# EAGLE design controller (EAGLE 6.4)
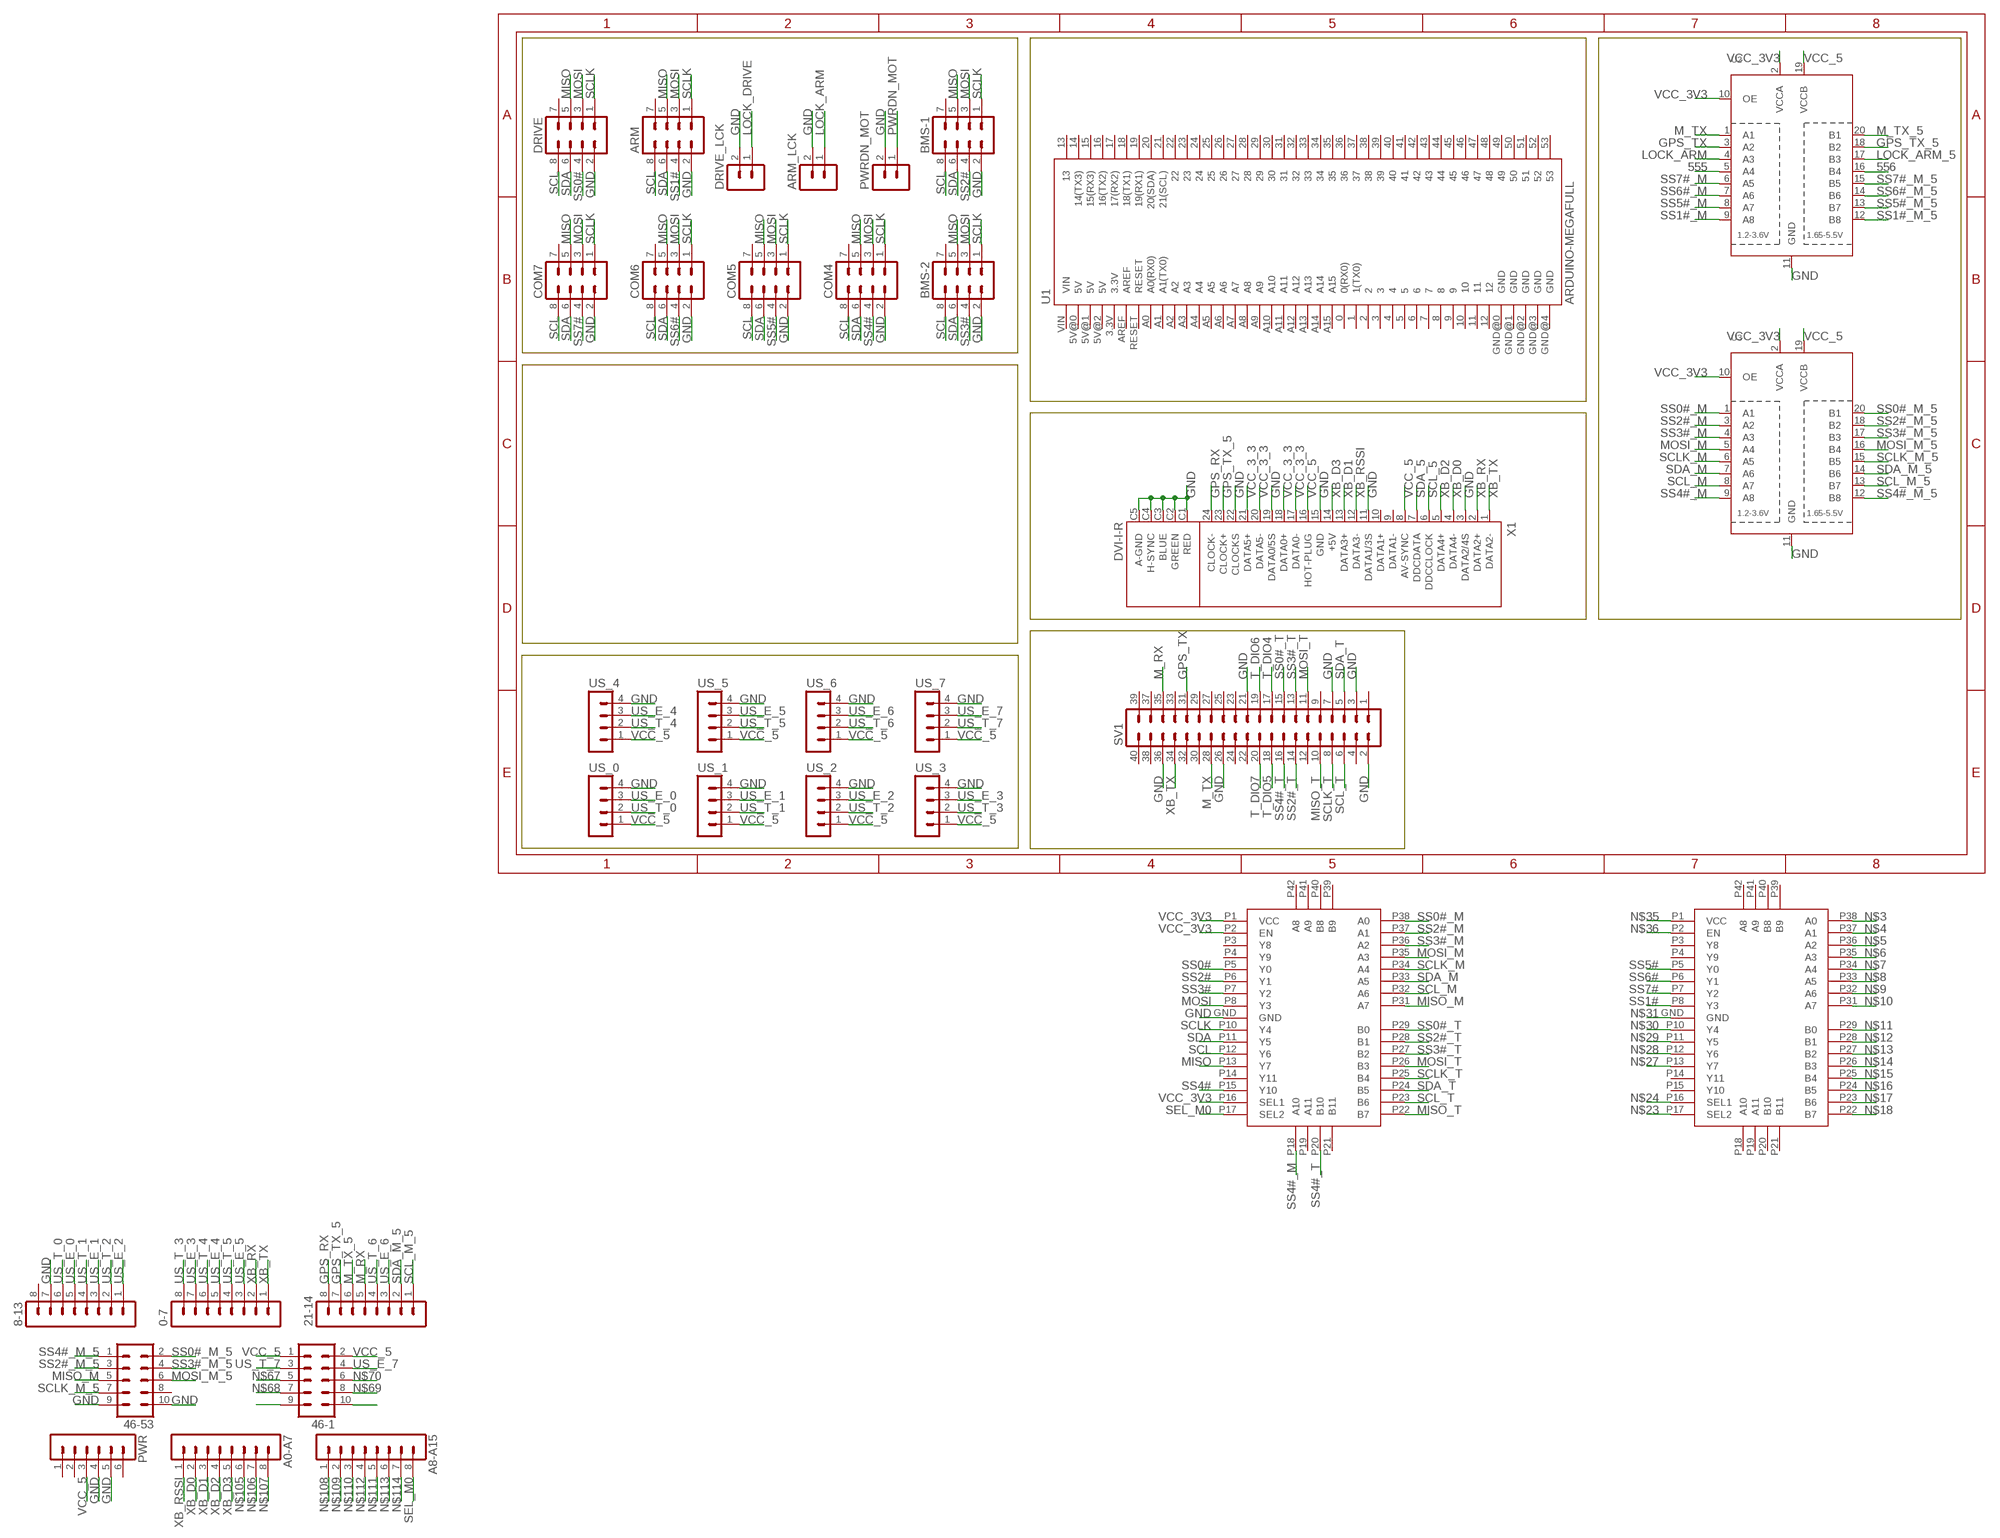
[diagram p0: schematic, sheet 1]

## Parts
0-7  MA08-1  [MA08-1]
8-13  MA08-1  [MA08-1]
21-14  MA08-1  [MA08-1]
46-1  MA05-2  [MA05-2]
46-53  MA05-2  [MA05-2]
A0-A7  MA08-1  [MA08-1]
A8-A15  MA08-1  [MA08-1]
ARM  MA04-2  [MA04-2]
ARM_LCK  MA02-1  [MA02-1]
BMS-1  MA04-2  [MA04-2]
BMS-2  MA04-2  [MA04-2]
COM4  MA04-2  [MA04-2]
COM5  MA04-2  [MA04-2]
COM6  MA04-2  [MA04-2]
COM7  MA04-2  [MA04-2]
DRIVE  MA04-2  [MA04-2]
DRIVE_LCK  MA02-1  [MA02-1]
PWR  MA06-1  [MA06-1]
PWRDN_MOT  MA02-1  [MA02-1]
SV1  MA20-2  [MA20-2]
U1  ARDUINO-MEGAFULL  [ARDUINO_MEGA]
U2  TXB0108PWR  [TSSOP20]
U3  TXB0108PWR  [TSSOP20]
U$5  TS3DV642RUA  [R-PWQFN-N42]
U$6  TS3DV642RUA  [R-PWQFN-N42]
US_0  MA04-1  [MA04-1]
US_1  MA04-1  [MA04-1]
US_2  MA04-1  [MA04-1]
US_3  MA04-1  [MA04-1]
US_4  MA04-1  [MA04-1]
US_5  MA04-1  [MA04-1]
US_6  MA04-1  [MA04-1]
US_7  MA04-1  [MA04-1]
X1  DVI-I-R  [DVI-I-R]

## Nets
555: U2.5(A4)
556: U2.16(B4)
GND: 8-13.7 46-53.9 46-53.10 ARM.2 ARM_LCK.2 BMS-1.2 BMS-2.2 COM4.2 COM5.2 COM6.2 COM7.2 DRIVE.2 DRIVE_LCK.2 PWR.4 PWR.5 PWRDN_MOT.2 SV1.2 SV1.3 SV1.7 SV1.21 SV1.26 SV1.36 U2.11(GND) U3.11(GND) U$5.GND US_0.4 US_1.4 US_2.4 US_3.4 US_4.4 US_5.4 US_6.4 US_7.4 X1.3(DATA2/4S) X1.11(DATA1/3S) X1.15(GND) X1.19(DATA0/5S) X1.22(CLOCKS) X1.C1(RED) X1.C2(GREEN) X1.C3(BLUE) X1.C4(H-SYNC) X1.C5(A-GND)
GPS_RX: 21-14.8 X1.24(CLOCK-)
GPS_TX: SV1.31 U2.3(A2)
GPS_TX_5: 21-14.7 U2.18(B2) X1.23(CLOCK+)
LOCK_ARM: ARM_LCK.1 U2.4(A3)
LOCK_ARM_5: U2.17(B3)
LOCK_DRIVE: DRIVE_LCK.1
M_RX: 21-14.5 SV1.35
M_TX: SV1.28 U2.1(A1)
M_TX_5: 21-14.6 U2.20(B1)
MISO: ARM.5 BMS-1.5 BMS-2.5 COM4.5 COM5.5 COM6.5 COM7.5 DRIVE.5 U$5.P13(Y7)
MISO_M: 46-53.5 U$5.P31(A7)
MISO_T: SV1.10 U$5.P22(B7)
MOSI: ARM.3 BMS-1.3 BMS-2.3 COM4.3 COM5.3 COM6.3 COM7.3 DRIVE.3 U$5.P8(Y3)
MOSI_M: U3.5(A4) U$5.P35(A3)
MOSI_M_5: 46-53.6 U3.16(B4)
MOSI_T: SV1.11 U$5.P26(B3)
N$1: 46-1.9
N$2: 46-1.10
N$3: U$6.P38(A0)
N$4: U$6.P37(A1)
N$5: U$6.P36(A2)
N$6: U$6.P35(A3)
N$7: U$6.P34(A4)
N$8: U$6.P33(A5)
N$9: U$6.P32(A6)
N$10: U$6.P31(A7)
N$11: U$6.P29(B0)
N$12: U$6.P28(B1)
N$13: U$6.P27(B2)
N$14: U$6.P26(B3)
N$15: U$6.P25(B4)
N$16: U$6.P24(B5)
N$17: U$6.P23(B6)
N$18: U$6.P22(B7)
N$23: U$6.P17(SEL2)
N$24: U$6.P16(SEL1)
N$27: U$6.P13(Y7)
N$28: U$6.P12(Y6)
N$29: U$6.P11(Y5)
N$30: U$6.P10(Y4)
N$31: U$6.GND
N$35: U$6.P1(VCC)
N$36: U$6.P2(EN)
N$67: 46-1.5
N$68: 46-1.7
N$69: 46-1.8
N$70: 46-1.6
N$105: A0-A7.6
N$106: A0-A7.7
N$107: A0-A7.8
N$108: A8-A15.1
N$109: A8-A15.2
N$110: A8-A15.3
N$111: A8-A15.5
N$112: A8-A15.4
N$113: A8-A15.6
N$114: A8-A15.7
PWRDN_MOT: PWRDN_MOT.1
SCL: ARM.8 BMS-1.8 BMS-2.8 COM4.8 COM5.8 COM6.8 COM7.8 DRIVE.8 U$5.P12(Y6)
SCL_5: X1.6(DDCCLOCK)
SCL_M: U3.8(A7) U$5.P32(A6)
SCL_M_5: 21-14.1 U3.13(B7)
SCL_T: SV1.6 U$5.P23(B6)
SCLK: ARM.1 BMS-1.1 BMS-2.1 COM4.1 COM5.1 COM6.1 COM7.1 DRIVE.1 U$5.P10(Y4)
SCLK_M: U3.6(A5) U$5.P34(A4)
SCLK_M_5: 46-53.7 U3.15(B5)
SCLK_T: SV1.8 U$5.P25(B4)
SDA: ARM.6 BMS-1.6 BMS-2.6 COM4.6 COM5.6 COM6.6 COM7.6 DRIVE.6 U$5.P11(Y5)
SDA_5: X1.7(DDCDATA)
SDA_M: U3.7(A6) U$5.P33(A5)
SDA_M_5: 21-14.2 U3.14(B6)
SDA_T: SV1.5 U$5.P24(B5)
SEL_M0: A8-A15.8 U$5.P17(SEL2)
SS0#: DRIVE.4 U$5.P5(Y0)
SS0#_M: U3.1(A1) U$5.P38(A0)
SS0#_M_5: 46-53.2 U3.20(B1)
SS0#_T: SV1.15 U$5.P29(B0)
SS1#: ARM.4 U$6.P8(Y3)
SS1#_M: U2.9(A8)
SS1#_M_5: U2.12(B8)
SS2#: BMS-1.4 U$5.P6(Y1)
SS2#_M: U3.3(A2) U$5.P37(A1)
SS2#_M_5: 46-53.3 U3.18(B2)
SS2#_T: SV1.14 U$5.P28(B1)
SS3#: BMS-2.4 U$5.P7(Y2)
SS3#_M: U3.4(A3) U$5.P36(A2)
SS3#_M_5: 46-53.4 U3.17(B3)
SS3#_T: SV1.13 U$5.P27(B2)
SS4#: COM4.4 U$5.P15(Y10)
SS4#_M: U3.9(A8) U$5.P18(A10)
SS4#_M_5: 46-53.1 U3.12(B8)
SS4#_T: SV1.16 U$5.P20(B10)
SS5#: COM5.4 U$6.P5(Y0)
SS5#_M: U2.8(A7)
SS5#_M_5: U2.13(B7)
SS6#: COM6.4 U$6.P6(Y1)
SS6#_M: U2.7(A6)
SS6#_M_5: U2.14(B6)
SS7#: COM7.4 U$6.P7(Y2)
SS7#_M: U2.6(A5)
SS7#_M_5: U2.15(B5)
T_DIO4: SV1.17
T_DIO5: SV1.18
T_DIO6: SV1.19
T_DIO7: SV1.20
US_E_0: 8-13.5 US_0.3
US_E_1: 8-13.3 US_1.3
US_E_2: 8-13.1 US_2.3
US_E_3: 0-7.7 US_3.3
US_E_4: 0-7.5 US_4.3
US_E_5: 0-7.3 US_5.3
US_E_6: 21-14.3 US_6.3
US_E_7: 46-1.4 US_7.3
US_T_0: 8-13.6 US_0.2
US_T_1: 8-13.4 US_1.2
US_T_2: 8-13.2 US_2.2
US_T_3: 0-7.8 US_3.2
US_T_4: 0-7.6 US_4.2
US_T_5: 0-7.4 US_5.2
US_T_6: 21-14.4 US_6.2
US_T_7: 46-1.3 US_7.2
VCC_3_3: X1.17(DATA0-) X1.18(DATA0+) X1.20(DATA5-) X1.21(DATA5+)
VCC_3V3: U2.2(VCCA) U2.10(OE) U3.2(VCCA) U3.10(OE) U$5.P1(VCC) U$5.P2(EN) U$5.P16(SEL1)
VCC_5: 46-1.1 46-1.2 PWR.3 U2.19(VCCB) U3.19(VCCB) US_0.1 US_1.1 US_2.1 US_3.1 US_4.1 US_5.1 US_6.1 US_7.1 X1.8(AV-SYNC) X1.16(HOT-PLUG)
XB_D0: A0-A7.2 X1.4(DATA4-)
XB_D1: A0-A7.3 X1.13(DATA3+)
XB_D2: A0-A7.4 X1.5(DATA4+)
XB_D3: A0-A7.5 X1.14(+5V)
XB_RSSI: A0-A7.1 X1.12(DATA3-)
XB_RX: 0-7.2 X1.2(DATA2+)
XB_TX: 0-7.1 SV1.34 X1.1(DATA2-)
Unconnected: 8-13.8 46-53.8 ARM.7 BMS-1.7 BMS-2.7 COM4.7 COM5.7 COM6.7 COM7.7 DRIVE.7 PWR.1 PWR.2 PWR.6 SV1.1 SV1.4 SV1.9 SV1.12 SV1.22 SV1.23 SV1.24 SV1.25 SV1.27 SV1.29 SV1.30 SV1.32 SV1.33 SV1.37 SV1.38 SV1.39 SV1.40 U1.0(0(RX0)) U1.1(1(TX0)) U1.2 U1.3 U1.3.3V U1.4 U1.5 U1.5V@0(5V) U1.5V@1(5V) U1.5V@2(5V) U1.6 U1.7 U1.8 U1.9 U1.10 U1.11 U1.12 U1.13 U1.14(14(TX3)) U1.15(15(RX3)) U1.16(16(TX2)) U1.17(17(RX2)) U1.18(18(TX1)) U1.19(19(RX1)) U1.20(20(SDA)) U1.21(21(SCL)) U1.22 U1.23 U1.24 U1.25 U1.26 U1.27 U1.28 U1.29 U1.30 U1.31 U1.32 U1.33 U1.34 U1.35 U1.36 U1.37 U1.38 U1.39 U1.40 U1.41 U1.42 U1.43 U1.44 U1.45 U1.46 U1.47 U1.48 U1.49 U1.50 U1.51 U1.52 U1.53 U1.A0(A0(RX0)) U1.A1(A1(TX0)) U1.A2 U1.A3 U1.A4 U1.A5 U1.A6 U1.A7 U1.A8 U1.A9 U1.A10 U1.A11 U1.A12 U1.A13 U1.A14 U1.A15 U1.AREF U1.GND@0(GND) U1.GND@1(GND) U1.GND@2(GND) U1.GND@3(GND) U1.GND@4(GND) U1.RESET U1.VIN U$5.P3(Y8) U$5.P4(Y9) U$5.P14(Y11) U$5.P19(A11) U$5.P21(B11) U$5.P39(B9) U$5.P40(B8) U$5.P41(A9) U$5.P42(A8) U$6.P3(Y8) U$6.P4(Y9) U$6.P14(Y11) U$6.P15(Y10) U$6.P18(A10) U$6.P19(A11) U$6.P20(B10) U$6.P21(B11) U$6.P39(B9) U$6.P40(B8) U$6.P41(A9) U$6.P42(A8) X1.9(DATA1-) X1.10(DATA1+)

## Power pins joined to a net without a drawn wire
AGND: X1.C6(AGND)

## Library data of the parts
0-7 8-13 21-14 A0-A7 A8-A15 = con-lstb:MA08-1: PIN HEADER; OC_FARNELL: unknown; OC_NEWARK: unknown
46-1 46-53 = con-lstb:MA05-2: PIN HEADER; OC_FARNELL: unknown; OC_NEWARK: unknown
ARM BMS-1 BMS-2 COM4-COM7 DRIVE = con-lstb:MA04-2: PIN HEADER; OC_FARNELL: unknown; OC_NEWARK: unknown
ARM_LCK DRIVE_LCK PWRDN_MOT = kamal:MA02-1: PIN HEADER; OC_FARNELL: unknown; OC_NEWARK: unknown
PWR = con-lstb:MA06-1: PIN HEADER; OC_FARNELL: unknown; OC_NEWARK: unknown
SV1 = con-lstb:MA20-2: PIN HEADER; OC_FARNELL: unknown; OC_NEWARK: unknown
U1 = SparkFun-Boards:ARDUINO-MEGA: Arduino Mega board footprint
U2 U3 = adafruit:TXB0108PWR: 8-Bit Bi-Directional Level Shifter 1.2V-3.6V (VCCA) to 1.65V-5.5V (VCCB) bi-directional level shifter with auto direction sensing. Max data rate - VCCA 1.8V: 20Mbps (50ns), VCCA 3.3V: 100Mbps (10ns) Digikey: 296-21527-1-ND
U$5 U$6 = kamal:TS3DV642
US_0 US_1-US_7 = con-lstb:MA04-1: PIN HEADER; OC_FARNELL: unknown; OC_NEWARK: unknown
X1 = con-molex:DVI-I-R: CONNECTOR MiroCross(TM)-DVI i/0 plug and receptacle connector system (scart); OC_FARNELL: unknown; OC_NEWARK: unknown

## Board
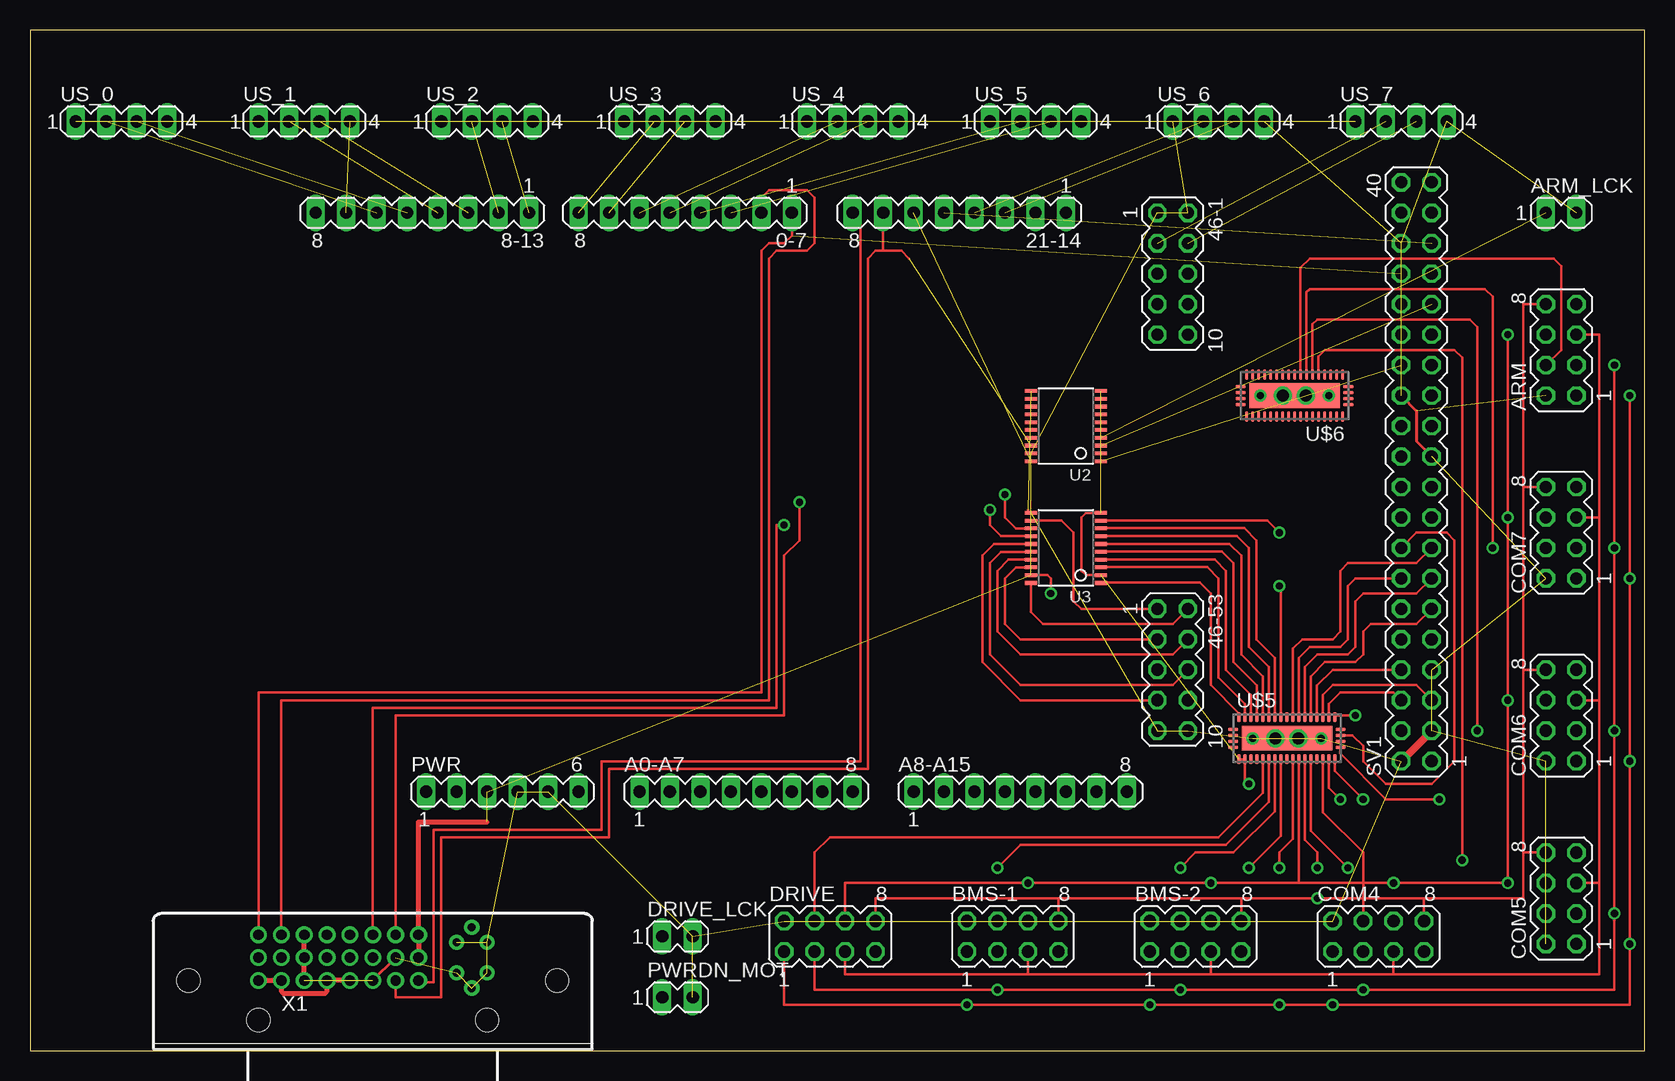
[diagram p1: board, top side]
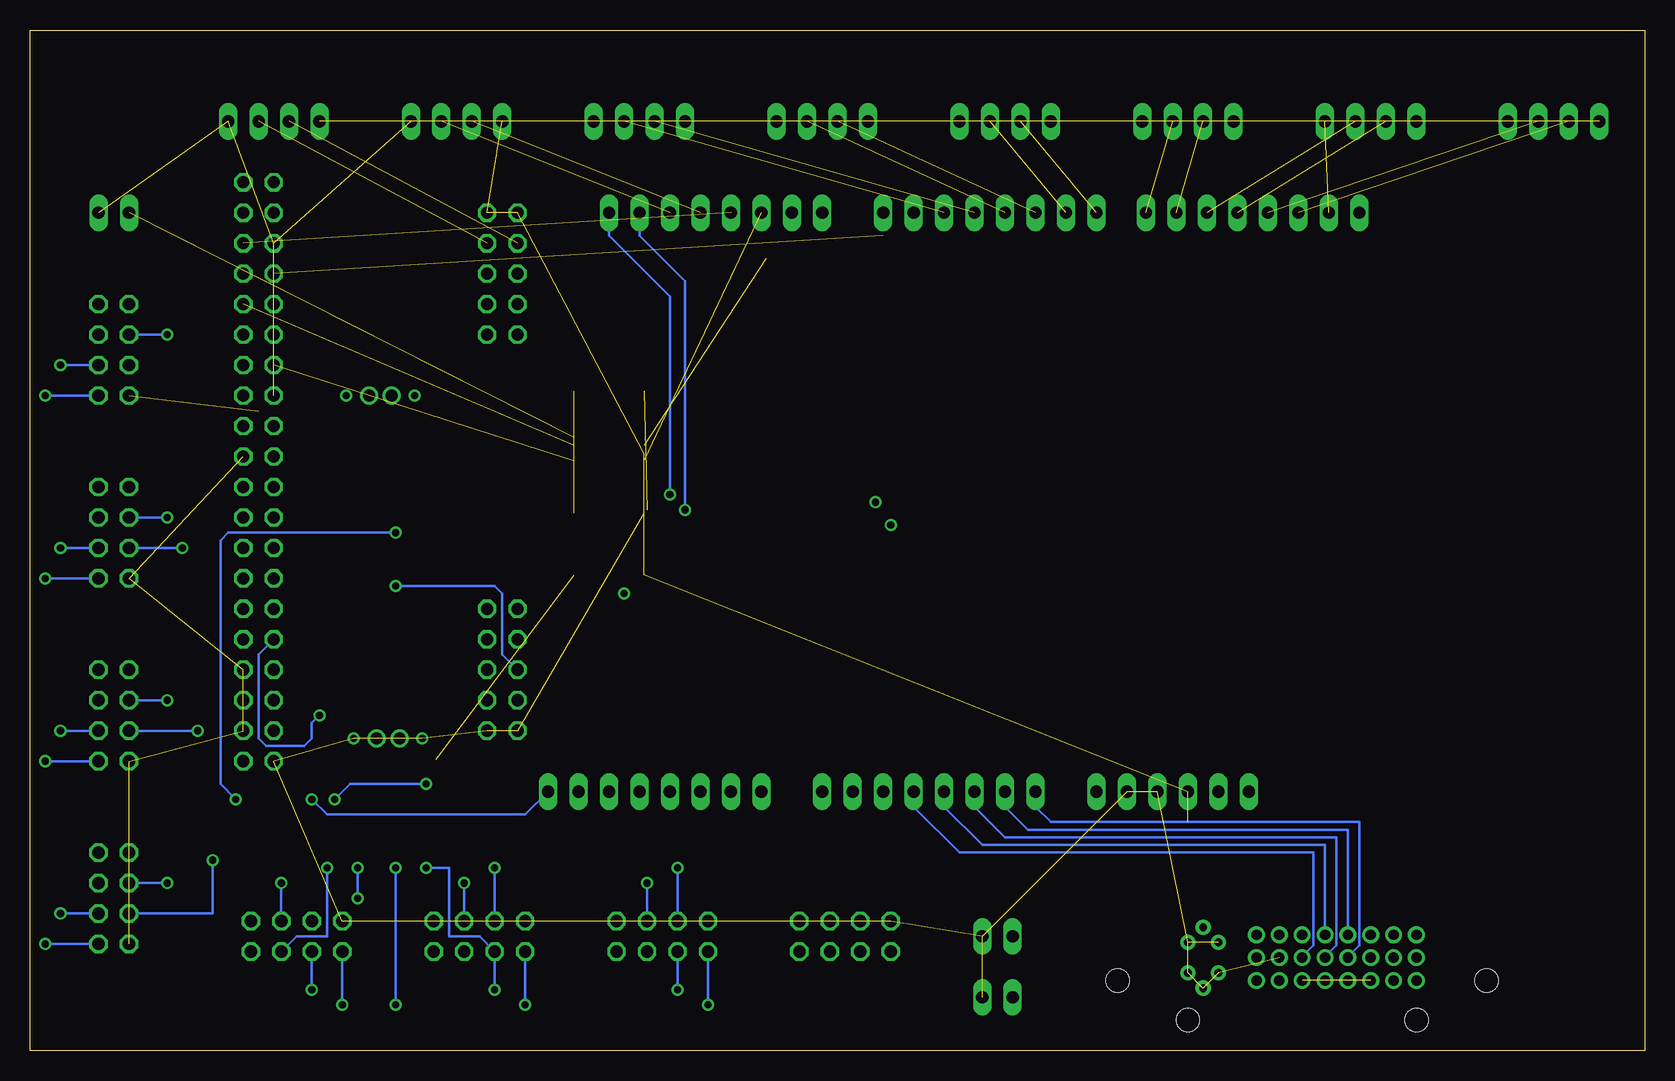
[diagram p2: board, bottom side, seen from below]

Size 134.62 x 85.09 mm. Coordinates in mm from the lower left corner, seen from the top.
Outline: 0,0 134.62,0 134.62,85.09 0,85.09 0,0
Copper layers (1*16): Top 0.035mm / dielectric 1.5mm / Bottom 0.035mm
Design rules "default": minimum track width 10mil, minimum drill 24mil, track to track 8mil, track to pad 8mil, pad to pad 8mil, via to via 8mil, smd to smd 8mil, copper to edge 40mil, drill to drill 8mil, minimum pad ring 10mil, minimum via ring 8mil, stop-mask expansion 4mil, vias tented up to drill 0mil, thermal gap 10mil

### Footprints (pad centres in the part's own frame; a part is rotated, then mirrored left to right if it is on the bottom)
MA08-1 = drill 1.016 long: 1 -8.89,0; 2 -6.35,0; 3 -3.81,0; 4 -1.27,0; 5 1.27,0; 6 3.81,0; 7 6.35,0; 8 8.89,0
MA05-2 = drill 1.016 octagon: 1 -5.08,-1.27; 2 -5.08,1.27; 3 -2.54,-1.27; 4 -2.54,1.27; 5 0,-1.27; 6 0,1.27; 7 2.54,-1.27; 8 2.54,1.27; 9 5.08,-1.27; 10 5.08,1.27
MA04-2 = drill 1.016 octagon: 1 -3.81,-1.27; 2 -3.81,1.27; 3 -1.27,-1.27; 4 -1.27,1.27; 5 1.27,-1.27; 6 1.27,1.27; 7 3.81,-1.27; 8 3.81,1.27
MA02-1 = drill 1.016 long: 1 -2.54,0; 2 0,0
MA06-1 = drill 1.016 long: 1 -6.35,0; 2 -3.81,0; 3 -1.27,0; 4 1.27,0; 5 3.81,0; 6 6.35,0
MA20-2 = drill 1.016 octagon: 1 -24.13,-1.27; 2 -24.13,1.27; 3 -21.59,-1.27; 4 -21.59,1.27; 5 -19.05,-1.27; 6 -19.05,1.27; 7 -16.51,-1.27; 8 -16.51,1.27; 9 -13.97,-1.27; 10 -13.97,1.27; 11 -11.43,-1.27; 12 -11.43,1.27; 13 -8.89,-1.27; 14 -8.89,1.27; 15 -6.35,-1.27; 16 -6.35,1.27; 17 -3.81,-1.27; 18 -3.81,1.27; 19 -1.27,-1.27; 20 -1.27,1.27; 21 1.27,-1.27; 22 1.27,1.27; 23 3.81,-1.27; 24 3.81,1.27; 25 6.35,-1.27; 26 6.35,1.27; 27 8.89,-1.27; 28 8.89,1.27; 29 11.43,-1.27; 30 11.43,1.27; 31 13.97,-1.27; 32 13.97,1.27; 33 16.51,-1.27; 34 16.51,1.27; 35 19.05,-1.27; 36 19.05,1.27; 37 21.59,-1.27; 38 21.59,1.27; 39 24.13,-1.27; 40 24.13,1.27
ARDUINO_MEGA = drill 1.016 pad 1.88: 0 63.5,50.8; 1 60.96,50.8; 2 58.42,50.8; 3 55.88,50.8; 3.3V 35.56,2.54; 4 53.34,50.8; 5 50.8,50.8; 5V@0 38.1,2.54; 5V@1 93.98,50.8; 5V@2 96.52,50.8; 6 48.26,50.8; 7 45.72,50.8; 8 41.656,50.8; 9 39.116,50.8; 10 36.576,50.8; 11 34.036,50.8; 12 31.496,50.8; 13 28.956,50.8; 14 68.58,50.8; 15 71.12,50.8; 16 73.66,50.8; 17 76.2,50.8; 18 78.74,50.8; 19 81.28,50.8; 20 83.82,50.8; 21 86.36,50.8; A0 50.8,2.54; A1 53.34,2.54; A2 55.88,2.54; A3 58.42,2.54; A4 60.96,2.54; A5 63.5,2.54; A6 66.04,2.54; A7 68.58,2.54; A8 73.66,2.54; A9 76.2,2.54; A10 78.74,2.54; A11 81.28,2.54; A12 83.82,2.54; A13 86.36,2.54; A14 88.9,2.54; A15 91.44,2.54; AREF 23.876,50.8; GND@0 40.64,2.54; GND@1 43.18,2.54; GND@2 93.98,7.62; GND@3 96.52,7.62; GND@4 26.416,50.8; RESET 33.02,2.54; VIN 45.72,2.54 | drill 1.016 pad 1.88 octagon: 22 93.98,48.26; 23 96.52,48.26; 24 93.98,45.72; 25 96.52,45.72; 26 93.98,43.18; 27 96.52,43.18; 28 93.98,40.64; 29 96.52,40.64; 30 93.98,38.1; 31 96.52,38.1; 32 93.98,35.56; 33 96.52,35.56; 34 93.98,33.02; 35 96.52,33.02; 36 93.98,30.48; 37 96.52,30.48; 38 93.98,27.94; 39 96.52,27.94; 40 93.98,25.4; 41 96.52,25.4; 42 93.98,22.86; 43 96.52,22.86; 44 93.98,20.32; 45 96.52,20.32; 46 93.98,17.78; 47 96.52,17.78; 48 93.98,15.24; 49 96.52,15.24; 50 93.98,12.7; 51 96.52,12.7; 52 93.98,10.16; 53 96.52,10.16 | hole 3.2: 15.24,50.8; 13.97,2.54; 66.04,35.56; 66.04,7.62; 90.17,50.8; 96.52,2.54
TSSOP20 = smd 0.305 x 0.991: 1 -2.925,-2.918; 2 -2.275,-2.918; 3 -1.625,-2.918; 4 -0.975,-2.918; 5 -0.325,-2.918; 6 0.325,-2.918; 7 0.975,-2.918; 8 1.625,-2.918; 9 2.275,-2.918; 10 2.925,-2.918; 11 2.925,2.918; 12 2.275,2.918; 13 1.625,2.918; 14 0.975,2.918; 15 0.325,2.918; 16 -0.325,2.918; 17 -0.975,2.918; 18 -1.625,2.918; 19 -2.275,2.918; 20 -2.925,2.918
R-PWQFN-N42 = smd 7.55 x 2.05: GND 0,0 | smd 0.28 x 0.85: P1 -4,-1.75; P2 -3.5,-1.75; P3 -3,-1.75; P4 -2.5,-1.75; P5 -2,-1.75; P6 -1.5,-1.75; P7 -1,-1.75; P8 -0.5,-1.75; P9 0,-1.75; P10 0.5,-1.75; P11 1,-1.75; P12 1.5,-1.75; P13 2,-1.75; P14 2.5,-1.75; P15 3,-1.75; P16 3.5,-1.75; P17 4,-1.75; P22 4,1.75; P23 3.5,1.75; P24 3,1.75; P25 2.5,1.75; P26 2,1.75; P27 1.5,1.75; P28 1,1.75; P29 0.5,1.75; P30 0,1.75; P31 -0.5,1.75; P32 -1,1.75; P33 -1.5,1.75; P34 -2,1.75; P35 -2.5,1.75; P36 -3,1.75; P37 -3.5,1.75; P38 -4,1.75 | smd 0.85 x 0.28: P18 4.485,-0.75; P19 4.485,-0.25; P20 4.485,0.25; P21 4.485,0.75; P39 -4.485,0.75; P40 -4.485,0.25; P41 -4.485,-0.25; P42 -4.485,-0.75
MA04-1 = drill 1.016 long: 1 -3.81,0; 2 -1.27,0; 3 1.27,0; 4 3.81,0
DVI-I-R = drill 0.864 pad 1.397: 1 -9.525,6.985; 2 -7.62,6.985; 3 -5.715,6.985; 4 -3.81,6.985; 5 -1.905,6.985; 6 0,6.985; 7 1.905,6.985; 8 3.81,6.985; 9 -9.525,5.08; 10 -7.62,5.08; 11 -5.715,5.08; 12 -3.81,5.08; 13 -1.905,5.08; 14 0,5.08; 15 1.905,5.08; 16 3.81,5.08; 17 -9.525,3.175; 18 -7.62,3.175; 19 -5.715,3.175; 20 -3.81,3.175; 21 -1.905,3.175; 22 0,3.175; 23 1.905,3.175; 24 3.81,3.175 | drill 0.66 pad 1.27: C1 6.985,6.35; C2 9.525,6.35; C3 6.985,3.81; C4 9.525,3.81; C5 8.255,2.54; C6 8.255,7.62 | hole 1.93: -15.367,3.175; 15.367,3.175; -9.525,-0.127; 9.525,-0.127

### Placement (x,y rotation side)
0-7  54.61,69.85 180 top
8-13  32.7,69.85 180 top
21-14  77.47,69.85 180 top
46-1  95.25,64.77 270 top
46-53  95.25,31.75 270 top
A0-A7  59.69,21.59 0 top
A8-A15  82.55,21.59 0 top
ARM  127.64,58.42 90 top
ARM_LCK  128.91,69.85 0 top
BMS-1  81.92,9.53 0 top
BMS-2  97.16,9.53 0 top
COM4  112.39,9.53 0 top
COM5  127.64,12.7 90 top
COM6  127.64,27.94 90 top
COM7  127.64,43.18 90 top
DRIVE  66.67,9.53 0 top
DRIVE_LCK  55.24,9.53 0 top
PWR  39.37,21.59 0 top
PWRDN_MOT  55.24,4.45 0 top
SV1  115.57,48.26 90 top
U1  221.93,21.27 0 top  (outside the outline)
U2  86.36,52.07 90 top
U3  86.36,41.91 90 top
U$5  104.78,26.04 0 top
U$6  105.41,54.61 180 top
US_0  7.62,77.47 0 top
US_1  22.86,77.47 0 top
US_2  38.1,77.47 0 top
US_3  53.34,77.47 0 top
US_4  68.58,77.47 0 top
US_5  83.82,77.47 0 top
US_6  99.06,77.47 0 top
US_7  114.3,77.47 0 top
X1  28.57,2.67 0 top

### Tracks (layer width: path | path; a pad name or v marks a point on that pad's centre or on a via)
GND  (via drill 0.6, 1)  (41 unrouted)
  Top 0.203: X1.3 X1.11 | U3.11 83.19,44.84 83.19,45.09
  Top 0.254: X1.22 X1.15 | SV1.26 115.57,53.34 115.57,50.8 SV1.21
  Top 0.406: X1.19 X1.3
  Top 0.61: SV1.2 SV1.3
  other vias: 103.82,26.04 105.73,26.04 101.92,26.04 107.63,26.04 106.36,54.61 104.46,54.61 108.27,54.61 102.55,54.61
GPS_RX
  Top 0.203: X1.24 32.38,5.71 33.66,5.71 33.66,18.41 47.62,18.41 47.62,24.13 69.22,24.13 69.22,69.22 21-14.8
GPS_TX  (1 unrouted)
GPS_TX_5  (1 unrouted)
  Top 0.203: X1.23 30.48,4.45 34.29,4.45 34.29,17.78 48.26,17.78 48.26,23.5 69.85,23.5 69.85,66.04 70.48,66.67 71.12,66.67 | 73.28,66.04 72.64,66.67 71.12,66.67 | 71.12,66.67 21-14.7
LOCK_ARM  (1 unrouted)
M_RX  (1 unrouted)
M_TX  (1 unrouted)
M_TX_5  (1 unrouted)
MISO  (via drill 0.6)
  Top 0.203: DRIVE.5 67.94,6.35 83.19,6.35 | BMS-1.5 83.19,6.35 | 83.19,6.35 98.42,6.35 | 113.67,6.35 130.81,6.35 130.81,13.97 | 130.81,13.97 130.81,29.21 | 130.81,44.45 130.81,29.21 | COM5.5 130.81,13.97 | COM6.5 130.81,29.21 | COM4.5 113.67,6.35 | BMS-2.5 98.42,6.35 | COM7.5 130.81,44.45 | 130.81,44.45 130.81,59.69 ARM.5 | 98.42,6.35 113.67,6.35 | U$5.P13 106.78,18.32 v109.86,15.24
  Bottom 0.203: v109.86,15.24 109.86,9.53 112.39,9.53 COM4.5
MISO_M  (via drill 0.6)
  Top 0.203: v104.14,38.73 104.28,38.73 U$5.P31
  Bottom 0.203: 46-53.5 95.25,33.02 95.25,38.1 95.89,38.73 v104.14,38.73
MISO_T  (via drill 0.6)
  Top 0.203: v110.49,27.94 108.78,27.94 U$5.P22
  Bottom 0.203: SV1.10 115.57,33.02 115.57,26.04 114.94,25.4 111.76,25.4 111.12,26.04 111.12,27.3 v110.49,27.94
MOSI  (via drill 0.6)
  Top 0.203: DRIVE.3 65.41,5.08 v80.64,5.08 v95.89,5.08 v111.12,5.08 132.08,5.08 v132.08,11.43 v132.08,26.67 v132.08,41.91 v132.08,57.15 | U$5.P8 104.28,17.91 v101.6,15.24
  Bottom 0.203: BMS-1.3 v80.64,5.08 | v95.89,5.08 BMS-2.3 97.16,9.53 99.69,9.53 99.69,15.24 v101.6,15.24 | COM4.3 v111.12,5.08 | COM5.3 v132.08,11.43 | COM6.3 v132.08,26.67 | COM7.3 v132.08,41.91 | v132.08,57.15 ARM.3
MOSI_M
  Top 0.203: U$5.P35 102.28,30.44 100.33,32.38 100.33,40.64 99.37,41.6 89.28,41.6 U3.5
MOSI_M_5
  Top 0.203: 46-53.6 95.25,30.48 82.55,30.48 80.01,33.02 80.01,40.64 80.95,41.59 U3.16
MOSI_T
  Top 0.203: SV1.11 115.57,35.56 111.76,35.56 111.12,34.92 111.12,33.02 110.49,32.38 107.95,32.38 106.78,31.21 U$5.P26
SCL  (via drill 0.6)
  Top 0.203: DRIVE.8 70.48,12.7 85.72,12.7 | BMS-1.8 85.72,12.7 | 85.72,12.7 100.97,12.7 | 100.97,12.7 v107.31,12.7 116.2,12.7 | 116.2,12.7 124.46,12.7 124.46,16.51 | 124.46,16.51 124.46,31.75 | 124.46,46.99 124.46,31.75 | 124.46,31.75 COM6.8 | BMS-2.8 100.97,12.7 | COM4.8 116.2,12.7 | COM5.8 124.46,16.51 | COM7.8 124.46,46.99 | 124.46,46.99 124.46,62.23 ARM.8 | U$5.P12 106.28,17.55 107.31,16.51 v107.31,15.24
  Bottom 0.203: v107.31,15.24 v107.31,12.7
SCL_5  (via drill 0.6)
  Top 0.203: X1.6 28.57,28.57 62.23,28.57 62.23,43.81 v62.87,43.81
SCL_M
  Top 0.203: U$5.P32 103.78,32.75 102.23,34.29 102.23,42.55 101.23,43.55 89.28,43.55 U3.8
SCL_M_5  (via drill 0.6)
  Top 0.203: U3.13 82.19,43.53 81.28,44.45 v81.28,46.35
  Bottom 0.203: v81.28,46.35 81.28,62.87 86.36,67.94 21-14.1
SCL_T
  Top 0.203: SV1.6 113.67,29.84 109.22,29.84 108.28,28.9 U$5.P23
SCLK  (via drill 0.6)
  Top 0.203: DRIVE.1 62.87,3.81 v78.11,3.81 v93.34,3.81 v104.14,3.81 v108.58,3.81 133.35,3.81 v133.35,8.89 v133.35,24.13 v133.35,39.37 v133.35,54.61 | U$5.P10 105.28,17.64 104.14,16.51 v104.14,15.24
  Bottom 0.203: BMS-1.1 v78.11,3.81 | BMS-2.1 v93.34,3.81 | COM4.1 v108.58,3.81 | COM5.1 v133.35,8.89 | COM6.1 v133.35,24.13 | COM7.1 v133.35,39.37 | v133.35,54.61 ARM.1 | v104.14,15.24 v104.14,3.81
SCLK_M
  Top 0.203: U$5.P34 102.78,31.21 100.97,33.02 100.97,41.27 99.99,42.25 89.28,42.25 U3.6
SCLK_M_5
  Top 0.203: 46-53.7 82.55,29.21 79.38,32.38 79.38,41.27 80.33,42.23 U3.15
SCLK_T
  Top 0.203: SV1.8 108.58,31.75 107.28,30.44 U$5.P25
SDA  (via drill 0.6)
  Top 0.203: DRIVE.6 67.94,13.97 v83.19,13.97 v98.42,13.97 105.78,13.97 | 105.78,13.97 v113.67,13.97 v123.19,13.97 v123.19,29.21 v123.19,44.45 v123.19,59.69 | U$5.P11 105.78,13.97
  Bottom 0.203: BMS-1.6 v83.19,13.97 | COM5.6 v123.19,13.97 | COM6.6 v123.19,29.21 | BMS-2.6 v98.42,13.97 | v113.67,13.97 COM4.6 | COM7.6 v123.19,44.45 | v123.19,59.69 ARM.6
SDA_5  (via drill 0.6)
  Top 0.203: X1.7 30.48,27.94 62.87,27.94 62.87,41.27 64.14,42.55 v64.14,45.72
SDA_M
  Top 0.203: U$5.P33 103.28,31.98 101.6,33.66 101.6,41.91 100.61,42.9 89.28,42.9 U3.7
SDA_M_5  (via drill 0.6)
  Top 0.203: U3.14 80.94,42.88 80.01,43.81 v80.01,45.09
  Bottom 0.203: v80.01,45.09 80.01,64.14 83.82,67.94 21-14.2
SDA_T
  Top 0.203: SV1.5 115.57,30.48 108.58,30.48 107.78,29.67 U$5.P24
SEL_M0  (via drill 0.6)
  Top 0.203: v111.12,20.95 108.78,23.3 U$5.P17
  Bottom 0.203: A8-A15.8 93.34,19.68 109.86,19.68 v111.12,20.95
SS0#
  Top 0.203: U$5.P5 102.78,21.5 99.06,17.78 66.67,17.78 65.41,16.51 DRIVE.4
SS0#_M
  Top 0.203: U$5.P38 100.78,28.13 98.42,30.48 98.42,38.1 97.51,39.02 89.28,39.02 U3.1
SS0#_M_5
  Top 0.203: 46-53.2 95.25,35.56 84.45,35.56 83.44,36.57 U3.20
SS0#_T
  Top 0.203: SV1.15 115.57,40.64 109.86,40.64 109.22,40.01 109.22,34.92 108.58,34.29 106.05,34.29 105.28,33.52 U$5.P29
SS1#
  Top 0.203: U$6.P8 105.91,65.27 106.68,66.04 127,66.04 127.64,65.41 127.64,58.42 ARM.4
SS2#  (via drill 0.6)
  Top 0.203: U$5.P6 103.28,20.73 99.69,17.14 82.55,17.14 v80.64,15.24
  Bottom 0.203: v80.64,15.24 BMS-1.4
SS2#_M
  Top 0.203: U$5.P37 101.28,28.9 99.06,31.11 99.06,39.37 98.13,40.3 89.28,40.3 U3.3
SS2#_M_5
  Top 0.203: 46-53.3 82.55,34.29 81.28,35.56 81.28,39.37 82.19,40.28 U3.18
SS2#_T
  Top 0.203: SV1.14 110.49,39.37 109.86,38.73 109.86,34.29 109.22,33.66 106.68,33.66 105.78,32.75 U$5.P28
SS3#  (via drill 0.6)
  Top 0.203: U$5.P7 103.78,19.95 100.33,16.51 97.16,16.51 v95.89,15.24
  Bottom 0.203: v95.89,15.24 BMS-2.4
SS3#_M
  Top 0.203: U$5.P36 101.78,29.67 99.69,31.75 99.69,40.01 98.75,40.95 89.28,40.95 U3.4
SS3#_M_5
  Top 0.203: 46-53.4 95.25,33.02 82.55,33.02 80.64,34.92 80.64,40.01 81.58,40.94 U3.17
SS3#_T
  Top 0.203: SV1.13 115.57,38.1 111.12,38.1 110.49,37.47 110.49,33.66 109.86,33.02 107.31,33.02 106.28,31.98 U$5.P27
SS4#
  Top 0.203: U$5.P15 107.78,19.86 111.12,16.51 COM4.4
SS4#_M  (via drill 0.6)
  Top 0.203: U3.9 103.14,44.19 v104.14,43.18 | v117.47,20.95 113.03,20.95 109.22,24.77 109.22,25.29 U$5.P18
  Bottom 0.203: v104.14,43.18 118.11,43.18 118.75,42.55 118.75,22.23 v117.47,20.95
SS4#_M_5
  Top 0.203: 46-53.1 87.63,36.83 87,37.47 87,43.18 85.99,44.19 U3.12
SS4#_T
  Top 0.203: SV1.16 115.57,43.18 118.11,43.18 118.75,42.55 118.75,24.13 116.84,22.23 113.03,22.23 111.12,24.13 111.12,25.4 110.24,26.29 U$5.P20
SS5#  (via drill 0.6)
  Top 0.203: U$6.P5 107.41,57.88 107.95,58.42 118.75,58.42 119.38,57.78 v119.38,15.88
  Bottom 0.203: v119.38,15.88 119.38,11.43 COM5.4
SS6#  (via drill 0.6)
  Top 0.203: U$6.P6 106.91,60.55 107.31,60.96 120.02,60.96 120.65,60.33 v120.65,26.67
  Bottom 0.203: v120.65,26.67 COM6.4
SS7#  (via drill 0.6)
  Top 0.203: U$6.P7 106.41,63.23 106.68,63.5 121.28,63.5 121.92,62.87 v121.92,41.91
  Bottom 0.203: v121.92,41.91 COM7.4
US_E_0  (1 unrouted)
US_E_1  (1 unrouted)
US_E_2  (1 unrouted)
US_E_3  (1 unrouted)
US_E_4  (1 unrouted)
US_E_5  (1 unrouted)
US_E_6  (1 unrouted)
US_E_7  (1 unrouted)
US_T_0  (1 unrouted)
US_T_1  (1 unrouted)
US_T_2  (1 unrouted)
US_T_3  (1 unrouted)
US_T_4  (1 unrouted)
US_T_5  (1 unrouted)
US_T_6  (1 unrouted)
US_T_7  (1 unrouted)
VCC_3_3
  Top 0.406: X1.21 X1.20 24.77,4.95 24.57,4.76 21.14,4.76 20.95,4.95 X1.18 X1.17
VCC_3V3  (via drill 0.6)  (3 unrouted)
  Top 0.203: U3.2 88,39.63 87.63,40.01 87.63,44.45 88.02,44.84 U3.10 | U$5.P1 U$5.P2 101.28,22.55 v101.6,22.23 | v109.22,20.95 108.28,21.9 U$5.P16
  Bottom 0.203: v101.6,22.23 107.95,22.23 v109.22,20.95
VCC_5  (via drill 0.6)  (13 unrouted)
  Top 0.203: U3.19 84.83,39.63 85.09,39.37 v85.09,38.1
  Top 0.406: X1.16 X1.8 32.38,19.05 38.1,19.05
XB_D0
  Bottom 0.203: X1.4 24.77,18.41 51.44,18.41 53.34,20.32 A0-A7.2
XB_D1
  Bottom 0.203: X1.13 26.67,7.81 25.72,8.76 25.72,17.78 53.34,17.78 55.88,20.32 A0-A7.3
XB_D2
  Bottom 0.203: X1.5 26.67,17.14 55.24,17.14 58.42,20.32 A0-A7.4
XB_D3
  Bottom 0.203: X1.14 28.57,7.81 27.62,8.76 27.62,16.51 57.15,16.51 60.96,20.32 A0-A7.5
XB_RSSI
  Bottom 0.203: X1.12 24.77,7.81 23.81,8.76 23.81,19.05 49.53,19.05 50.8,20.32 A0-A7.1
XB_RX
  Top 0.203: X1.2 20.95,29.21 61.59,29.21 61.59,66.04 62.23,66.67 64.77,66.67 65.41,67.31 65.41,71.12 64.77,71.75 61.59,71.75 60.96,71.12 0-7.2
XB_TX  (1 unrouted)
  Top 0.203: X1.1 19.05,29.84 60.96,29.84 60.96,66.67 61.59,67.31 62.87,67.31 63.5,67.94 0-7.1